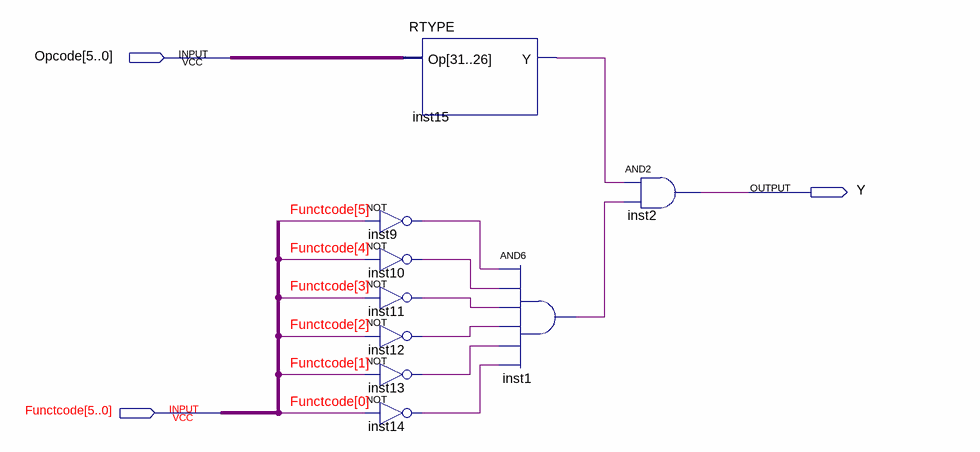
[diagram p0: schematic sheet]
// Quartus schematic SLL.bdf as structural Verilog: 9 symbols, 3 pins
module SLL (
  input  [5:0] Opcode,
  input  [5:0] Functcode,
  output Y
);

  wire inst1_out, inst9_out, inst10_out, inst11_out, inst12_out, inst13_out, inst14_out, inst15_y;

  RTYPE inst15 (.Op(Opcode), .Y(inst15_y));
  not inst9 (inst9_out, Functcode[5]);
  not inst10 (inst10_out, Functcode[4]);
  not inst11 (inst11_out, Functcode[3]);
  not inst12 (inst12_out, Functcode[2]);
  not inst13 (inst13_out, Functcode[1]);
  not inst14 (inst14_out, Functcode[0]);
  and inst1 (inst1_out, inst9_out, inst10_out, inst11_out, inst12_out, inst13_out, inst14_out);
  and inst2 (Y, inst15_y, inst1_out);
endmodule
